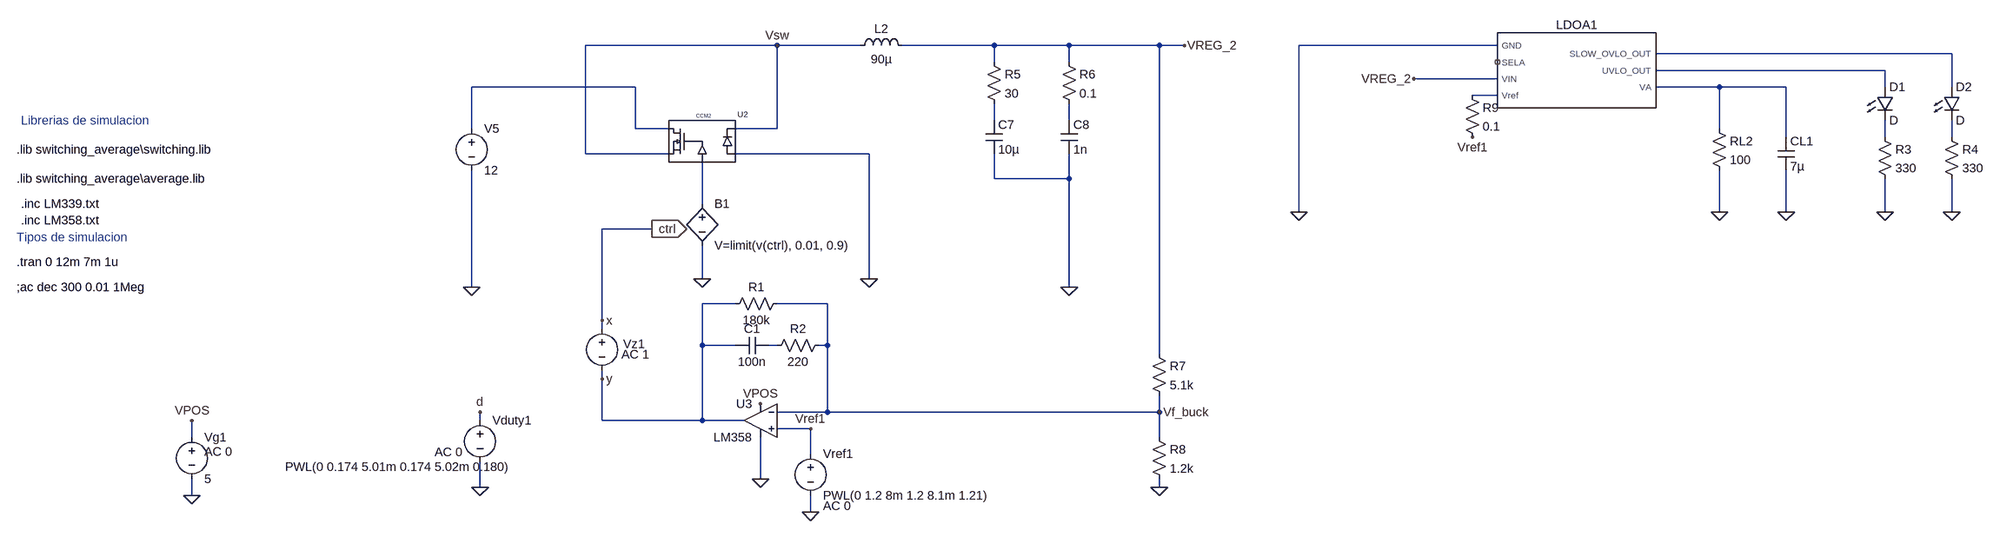
[diagram p0: schematic BUCK_LDO_v1_average.asc]
BUCK_LDO_v1_average.asc, the LTspice schematic file:
Version 4
SHEET 1 2004 1704
WIRE -688 576 -1056 576
WIRE -528 576 -688 576
WIRE -272 576 -448 576
WIRE -128 576 -272 576
WIRE 48 576 -128 576
WIRE 96 576 48 576
WIRE 880 576 496 576
WIRE 1888 592 1184 592
WIRE -272 608 -272 576
WIRE -128 608 -128 576
WIRE 1760 624 1184 624
WIRE 880 640 720 640
WIRE -960 656 -1424 656
WIRE 1424 656 1184 656
WIRE 1552 656 1424 656
WIRE 1760 656 1760 624
WIRE 1888 656 1888 592
WIRE 880 672 832 672
WIRE -272 720 -272 688
WIRE -128 720 -128 688
WIRE -1424 736 -1424 656
WIRE -960 736 -960 656
WIRE -896 736 -960 736
WIRE -688 736 -688 576
WIRE -688 736 -768 736
WIRE 1424 736 1424 656
WIRE 1552 752 1552 656
WIRE 1760 752 1760 720
WIRE 1888 752 1888 720
WIRE -1056 784 -1056 576
WIRE -896 784 -1056 784
WIRE -512 784 -768 784
WIRE -272 832 -272 784
WIRE -128 832 -128 784
WIRE -128 832 -272 832
WIRE -832 880 -832 800
WIRE 496 896 496 576
WIRE 1424 896 1424 816
WIRE 1552 896 1552 816
WIRE 1760 896 1760 832
WIRE 1888 896 1888 832
WIRE -928 928 -1024 928
WIRE -832 1024 -832 960
WIRE -512 1024 -512 784
WIRE -1424 1040 -1424 816
WIRE -128 1040 -128 832
WIRE -768 1072 -832 1072
WIRE -592 1072 -688 1072
WIRE -1024 1104 -1024 928
WIRE -1024 1120 -1024 1104
WIRE -832 1152 -832 1072
WIRE -768 1152 -832 1152
WIRE -688 1152 -704 1152
WIRE -592 1152 -592 1072
WIRE -592 1152 -608 1152
WIRE 48 1168 48 576
WIRE -1024 1216 -1024 1200
WIRE -592 1280 -592 1152
WIRE -592 1280 -688 1280
WIRE 48 1280 48 1248
WIRE 48 1280 -592 1280
WIRE -1408 1296 -1408 1280
WIRE -1024 1296 -1024 1216
WIRE -832 1296 -832 1152
WIRE -832 1296 -1024 1296
WIRE -752 1296 -832 1296
WIRE -624 1312 -688 1312
WIRE -1984 1328 -1984 1296
WIRE 48 1328 48 1280
WIRE -624 1360 -624 1312
WIRE -720 1408 -720 1328
WIRE -1408 1424 -1408 1376
WIRE 48 1424 48 1408
WIRE -1984 1440 -1984 1408
WIRE -624 1472 -624 1440
FLAG -1408 1424 0
FLAG -1408 1280 d
FLAG -1424 1040 0
FLAG 96 576 VREG_2
FLAG -512 1024 0
FLAG -128 1040 0
FLAG -688 576 Vsw
FLAG 48 1424 0
FLAG -720 1408 0
FLAG -624 1472 0
FLAG -832 1024 0
FLAG -928 928 ctrl
IOPIN -928 928 Out
FLAG -1024 1104 x
FLAG -1024 1216 y
FLAG 48 1280 Vf_buck
FLAG -1984 1440 0
FLAG -720 1264 VPOS
FLAG -1984 1296 VPOS
FLAG 496 896 0
FLAG 1552 896 0
FLAG 1424 896 0
FLAG 1760 896 0
FLAG 1888 896 0
FLAG 720 640 VREG_2
FLAG -624 1312 Vref1
FLAG 832 752 Vref1
SYMBOL voltage -1408 1280 R0
WINDOW 3 -374 105 Left 2
WINDOW 123 -87 77 Left 2
WINDOW 39 0 0 Left 2
SYMATTR Value PWL(0 0.174 5.01m 0.174 5.02m 0.180)
SYMATTR Value2 AC 0
SYMATTR InstName Vduty1
SYMBOL voltage -1424 720 R0
WINDOW 123 0 0 Left 0
WINDOW 39 0 0 Left 0
SYMATTR InstName V5
SYMATTR Value 12
SYMBOL ind -544 592 R270
WINDOW 0 32 56 VTop 2
WINDOW 3 5 56 VBottom 2
SYMATTR InstName L2
SYMATTR Value 90µ
SYMBOL cap -288 720 R0
SYMATTR InstName C7
SYMATTR Value 10µ
SYMBOL cap -144 720 R0
SYMATTR InstName C8
SYMATTR Value 1n
SYMBOL res -288 592 R0
SYMATTR InstName R5
SYMATTR Value 30
SYMBOL res -144 592 R0
SYMATTR InstName R6
SYMATTR Value 0.1
SYMBOL res 32 1152 R0
SYMATTR InstName R7
SYMATTR Value 5.1k
SYMBOL res 32 1312 R0
SYMATTR InstName R8
SYMATTR Value 1.2k
SYMBOL voltage -624 1344 R0
WINDOW 123 24 116 Left 2
WINDOW 39 24 124 Left 2
SYMATTR Value2 AC 0
SYMATTR InstName Vref1
SYMATTR Value PWL(0 1.2 8m 1.2 8.1m 1.21)
SYMBOL bv -832 864 R0
SYMATTR InstName B1
SYMATTR Value V=limit(v(ctrl), 0.01, 0.9)
SYMBOL voltage -1024 1104 R0
WINDOW 0 41 45 Left 2
WINDOW 123 37 65 Left 2
WINDOW 39 0 0 Left 2
SYMATTR InstName Vz1
SYMATTR Value2 AC 1
SYMATTR Value ""
SYMBOL voltage -1984 1312 R0
WINDOW 123 24 44 Left 2
WINDOW 39 0 0 Left 0
SYMATTR Value2 AC 0
SYMATTR InstName Vg1
SYMATTR Value 5
SYMBOL Opamps\\opamp2 -720 1232 M0
SYMATTR InstName U3
SYMATTR Value LM358
SYMBOL ccm1 -832 768 R0
SYMATTR InstName U2
SYMATTR Value CCM2
SYMATTR SpiceLine Ron=0.16
SYMATTR SpiceLine2 VD=0 RD=0.16
SYMBOL cap -704 1136 R90
WINDOW 0 0 32 VBottom 2
WINDOW 3 32 32 VTop 2
SYMATTR InstName C1
SYMATTR Value 100n
SYMBOL res -672 1056 R90
WINDOW 0 0 56 VBottom 2
WINDOW 3 32 56 VTop 2
SYMATTR InstName R1
SYMATTR Value 180k
SYMBOL res -592 1136 R90
WINDOW 0 0 56 VBottom 2
WINDOW 3 32 56 VTop 2
SYMATTR InstName R2
SYMATTR Value 220
SYMBOL Regulador_LDOA_v9_symbol 1024 624 R0
SYMATTR InstName LDOA1
SYMBOL res 1408 720 R0
SYMATTR InstName RL2
SYMATTR Value 100
SYMBOL cap 1536 752 R0
SYMATTR InstName CL1
SYMATTR Value 7µ
SYMBOL res 1744 736 R0
SYMATTR InstName R3
SYMATTR Value 330
SYMBOL res 1872 736 R0
SYMATTR InstName R4
SYMATTR Value 330
SYMBOL LED 1744 656 R0
SYMATTR InstName D1
SYMBOL LED 1872 656 R0
SYMATTR InstName D2
SYMBOL res 816 656 R0
SYMATTR InstName R9
SYMATTR Value 0.1
TEXT -2320 776 Left 2 !.lib switching_average\\switching.lib
TEXT -2320 832 Left 2 !.lib switching_average\\average.lib
TEXT -2312 720 Left 2 ;Librerias de simulacion
TEXT -2320 992 Left 2 !.tran 0 12m 7m 1u
TEXT -2320 1040 Left 2 !;ac dec 300 0.01 1Meg
TEXT -2320 944 Left 2 ;Tipos de simulacion
TEXT -2312 880 Left 2 !.inc LM339.txt
TEXT -2312 912 Left 2 !.inc LM358.txt

The netlist it stands for:
* BUCK_LDO_v1_average.asc
Vduty1 d 0 PWL(0 0.174 5.01m 0.174 5.02m 0.180) AC 0
V5 N003 0 12
L2 Vsw VREG_2 90µ
C7 N006 0 10µ
C8 N007 0 1n
R5 VREG_2 N006 30
R6 VREG_2 N007 0.1
R7 VREG_2 Vf_buck 5.1k
R8 Vf_buck 0 1.2k
Vref1 Vref1 0 PWL(0 1.2 8m 1.2 8.1m 1.21) AC 0
B1 N010 0 V=limit(v(ctrl), 0.01, 0.9)
Vz1 x y AC 1
Vg1 VPOS 0 5 AC 0
XU3 Vref1 Vf_buck VPOS 0 y LM358  ; pins In+ In- V+ V- OUT
XU2 N003 Vsw Vsw 0 N010 CCM2 Ron=0.16 VD=0 RD=0.16  ; pins 1 2 3 4 5
C1 N011 y 100n
R1 Vf_buck y 180k
R2 Vf_buck N011 220
XLDOA1 0 NC_01 VREG_2 N005 N001 N002 N004 Regulador_LDOA_v9_symbol  ; pins GND SELA VIN Vref SLOW_OVLO_OUT UVLO_OUT VA
RL2 N004 0 100
CL1 N004 0 7µ
R3 N008 0 330
R4 N009 0 330
D1 N002 N008 D
D2 N001 N009 D
R9 N005 Vref1 0.1
.model D D
.lib standard.dio
.lib switching_average\switching.lib
.lib switching_average\average.lib
* Librerias de simulacion
.tran 0 12m 7m 1u
;ac dec 300 0.01 1Meg
* Tipos de simulacion
.inc LM339.txt
.inc LM358.txt
.backanno
.end